# EAGLE schematic Grove  - XBee Carrier v1.0 (EAGLE 9.4.2)
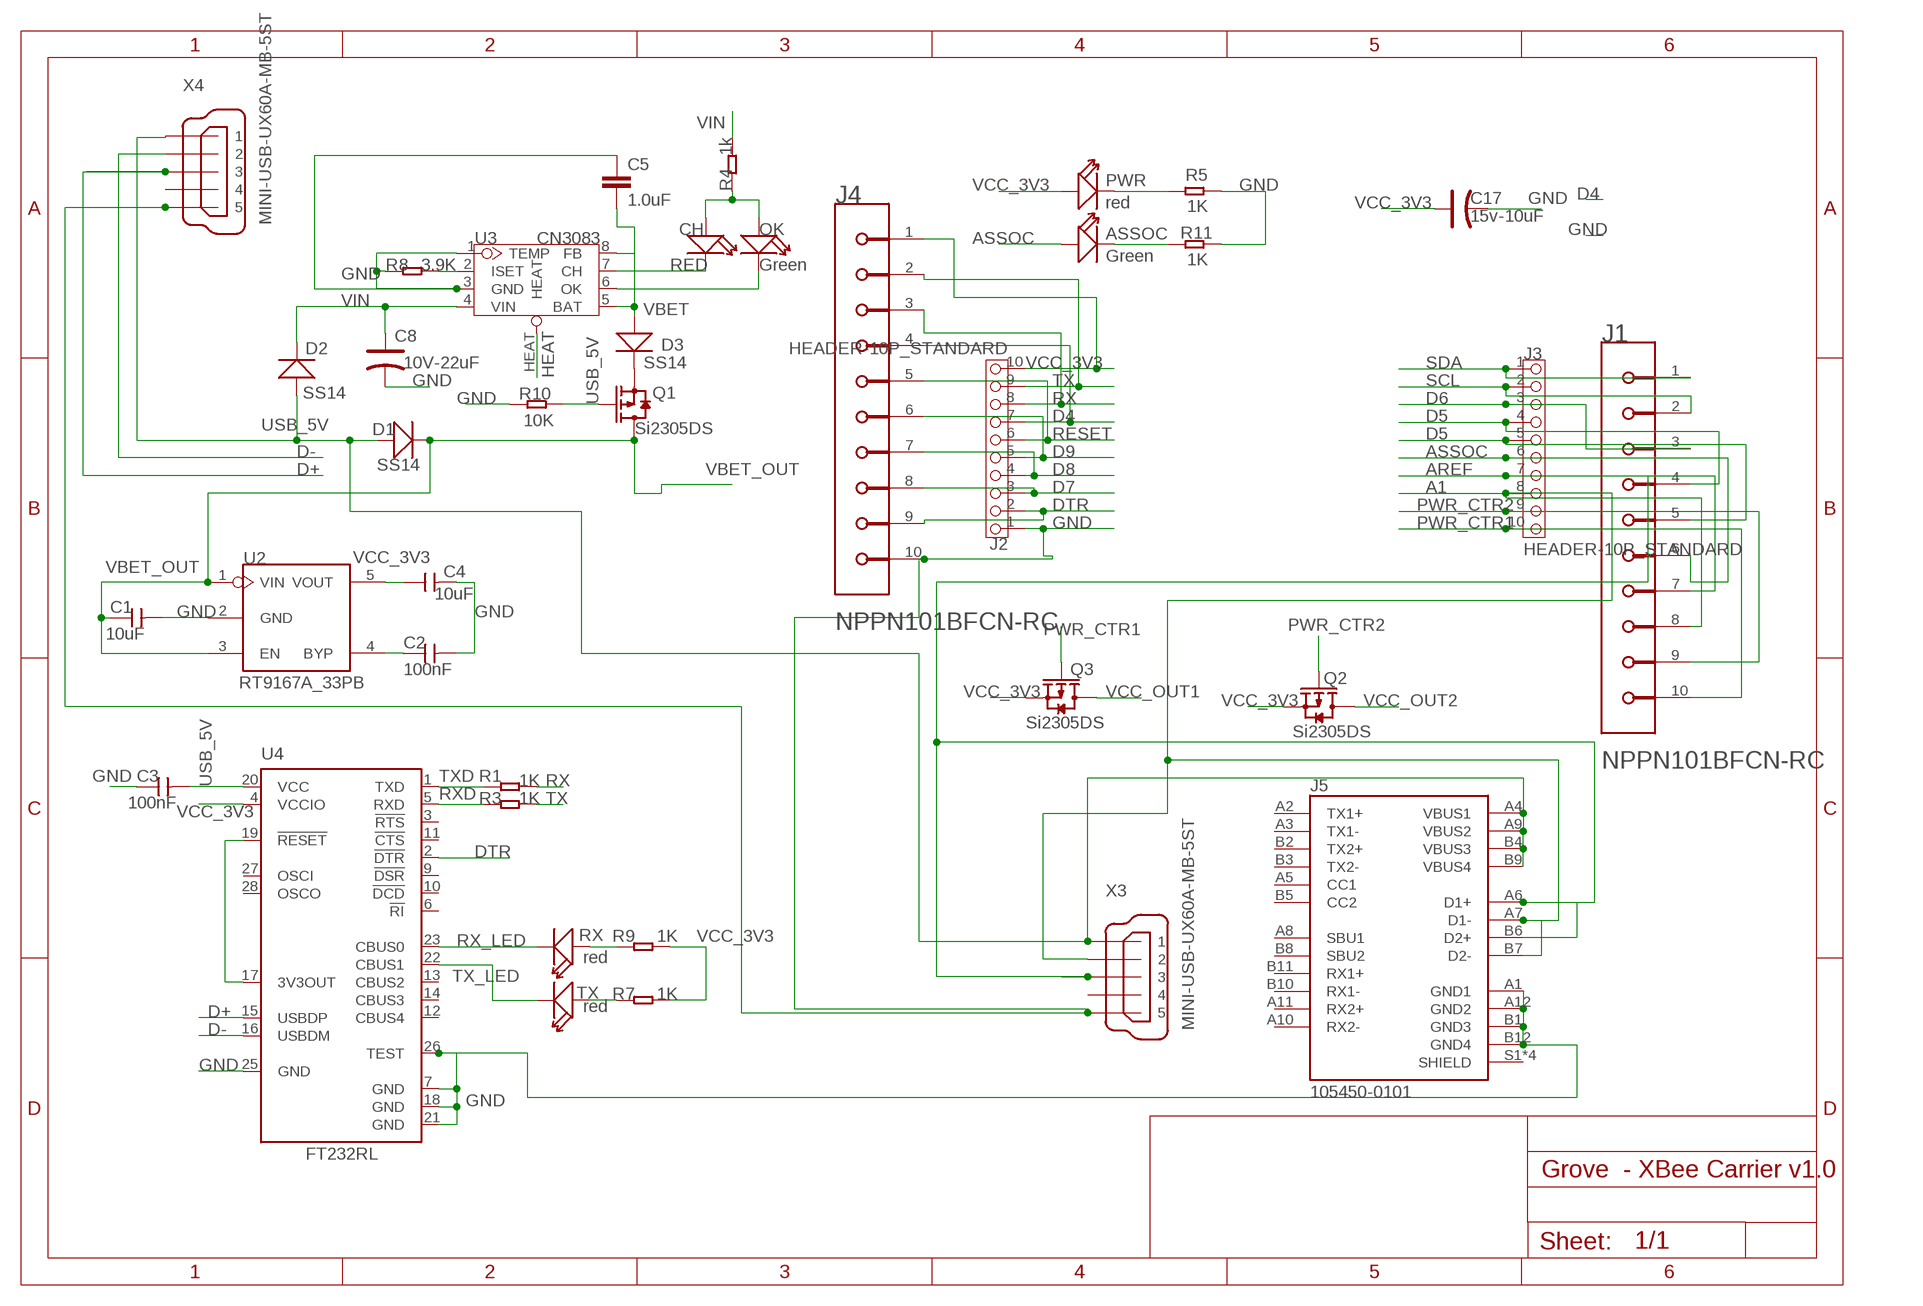
[diagram p0: schematic, sheet 1]

## Parts
ASSOC  Green  LED-0603  [D0603]
C1  10uF  C-0805  [0805]
C2  100nF  C-0603  [0603]
C3  100nF  C-0603  [0603]
C4  10uF  C-0805  [0805]
C5  1.0uF  1.0UF-0805-25V-10%  [0805]
C8  10V-22uF  CAP_AVX_B  [AVX-B]
C17  15v-10uF  CAP_AVX_A  [AVX-A]
CH  RED  LED-0603  [D0603]
D1  SS14  D-2010  [D2010]
D2  SS14  D-2010  [D2010]
D3  SS14  D-2010  [D2010]
J1  SULLINS_NPPN101BFCN-RCSULLINS_NPPN101BFCN-RC_0_0  [SULLINS_NPPN101BFCN-RC_0]
J2  HEADER-10P_STANDARD  [2.54_10P]
J3  HEADER-10P_STANDARD  [2.54_10P]
J4  SULLINS_NPPN101BFCN-RCSULLINS_NPPN101BFCN-RC_0_0  [SULLINS_NPPN101BFCN-RC_0]
J5  105450-0101  [MOLEX_105450-0101]
OK  Green  LED-0603  [D0603]
PWR  red  LED-0805  [D0805]
Q1  Si2305DS  010-P-MOSFETSOT23  [SOT23]
Q2  Si2305DS  010-P-MOSFETSOT23  [SOT23]
Q3  Si2305DS  010-P-MOSFETSOT23  [SOT23]
R1  1K  R-0603  [0603]
R3  1K  R-0603  [0603]
R4  1k  R-0603  [0603]
R5  1K  R-0603  [0603]
R7  1K  R-0603  [0603]
R8  3.9K  R-0603  [0603]
R9  1K  R-0603  [0603]
R10  10K  R-0603  [0603]
R11  1K  R-0603  [0603]
RX  red  LED-0603  [D0603]
TX  red  LED-0603  [D0603]
U2  RT9167A_33PB  RT9167A  [SOT23-5]
U3  CN3083  [SOP8]
U4  FT232RL  [SSOP28]
X3  MINI-USB-UX60A-MB-5ST  [UX60A-MB-5ST]
X4  MINI-USB-UX60A-MB-5ST  [UX60A-MB-5ST]

## Nets
A1: J1.8 J3.8 J5.A7(D1-) J5.B7(D2-) X3.2
AREF: J1.7 J3.7 J5.A6(D1+) J5.B6(D2+) X3.3
ASSOC: ASSOC.+ J1.6 J3.6
D4: J2.7 J4.4
D5: J1.4 J1.5 J3.4 J3.5
D6: J1.3 J3.3
D7: J2.3 J4.8
D8: J2.4 J4.7
D9: J2.5 J4.6
D+: U4.15(USBDP) X4.3
D-: U4.16(USBDM) X4.2
DTR: J2.2 J4.9 U4.2(!DTR)
GND: C1.2 C2.2 C3.1 C4.2 C5.1 C8.- C17.- J2.1 J4.10 J5.A1(GND1) J5.A12(GND2) J5.B1(GND3) J5.B12(GND4) R5.1 R8.1 R10.1 R11.1 U2.2(GND) U3.1(TEMP) U3.3(GND) U4.7(GND) U4.18(GND) U4.21(GND) U4.25(GND) U4.26(TEST) X3.5 X4.5
HEAT: U3.HEAT
N$1: PWR.- R5.2
N$2: R8.2 U3.2(ISET)
N$6: C2.1 U2.4(BYP)
N$7: CH.- U3.7(CH)
N$8: OK.- U3.6(OK)
N$9: CH.+ OK.+ R4.1
N$10: U4.17(3V3OUT) U4.19(!RESET)
N$11: D3.- Q1.2(S)
N$12: ASSOC.- R11.2
N$15: R9.1 RX.+
N$16: R7.1 TX.+
PWR_CTR1: J1.10 J3.10 Q3.1(G)
PWR_CTR2: J1.9 J3.9 Q2.1(G)
RESET: J2.6 J4.5
RX: J2.8 J4.3 R1.2
RX_LED: RX.- U4.23(CBUS0)
RXD: R3.1 U4.5(RXD)
SCL: J1.2 J3.2
SDA: J1.1 J3.1
TX: J2.9 J4.2 R3.2
TX_LED: TX.- U4.22(CBUS1)
TXD: R1.1 U4.1(TXD)
USB_5V: C3.2 D1.+ D2.+ J5.A4(VBUS1) J5.A9(VBUS2) J5.B4(VBUS3) J5.B9(VBUS4) Q1.1(G) R10.2 U4.20(VCC) X3.1 X4.1
VBET: C5.2 D3.+ U3.5(BAT) U3.8(FB)
VBET_OUT: C1.1 D1.- Q1.3(D) U2.1(VIN) U2.3(EN)
VCC_3V3: C4.1 C17.+ J2.10 J4.1 PWR.+ Q2.2(S) Q3.2(S) R7.2 R9.2 U2.5(VOUT) U4.4(VCCIO)
VCC_OUT1: Q3.3(D)
VCC_OUT2: Q2.3(D)
VIN: C8.+ D2.- R4.2 U3.4(VIN)
Unconnected: J5.A2(TX1+) J5.A3(TX1-) J5.A5(CC1) J5.A8(SBU1) J5.A10(RX2-) J5.A11(RX2+) J5.B2(TX2+) J5.B3(TX2-) J5.B5(CC2) J5.B8(SBU2) J5.B10(RX1-) J5.B11(RX1+) J5.S1(SHIELD) J5.S2(SHIELD) J5.S3(SHIELD) J5.S4(SHIELD) U4.3(!RTS) U4.6(!RI) U4.9(!DSR) U4.10(!DCD) U4.11(!CTS) U4.12(CBUS4) U4.13(CBUS2) U4.14(CBUS3) U4.27(OSCI) U4.28(OSCO) X3.4 X4.4

## Library data of the parts
ASSOC CH OK PWR RX TX = discrete:LED*
C1-C4 = discrete:C*: Ceramic Capacitors
C5 = SparkFun-Capacitors:1.0UF: 1µF ceramic capacitors A capacitor is a passive two-terminal electrical component used to store electrical energy temporarily in an electric field.; PROD_ID: CAP-08064
C8 C17 = discrete:CAP*: Electrolytic Capacitors,Tantalum Capacitors and Super Capacitors
D1-D3 = discrete:D*
J1 J4 = Sullins - NPPN101BFCN-RC:SULLINS_NPPN101BFCN-RC: HEADER, FEMALE 2mm CC, 1 ROW, ST; CENTROID_NOT_SPECIFIED: No; CONNECTOR_TYPE: Female; DATASHEET: http://www.sullinscorp.com/drawings/75_1BFC_10483.pdf; DIGIKEY_DESCRIPTION: CONN RECEPT 2MM SINGLE STR 10POS; DIGIKEY_PART_NUMBER: S5751-10-ND; IS_FEMALE: yes; LEAD_FREE: yes; MF: Sullins; MPN: NPPN101BFCN-RC; NUMBER_OF_PINS: 10; NUM_PINS: 10; PACKAGE: CONN_PTH_RCT10; PIN_PITCH: 2 mm; PREFIX: J; ROHS: yes; ROWS: 1; TEMPERATURE_RANGE_HIGH: +105°C; TEMPERATURE_RANGE_LOW: -40°C
J2 J3 = Connector:HEADER-10P
J5 = 105450-0101:105450-0101: USB Shielded I/O Receptacle; Type C; Right Angle; Surface Mount; Gold over Nickel; DESCRIPTION: USB Shielded I/O Receptacle; Type C; Right Angle; Surface Mount; Gold over Nickel; DIGI-KEY_PART_NUMBER: WM12856CT-ND; DIGI-KEY_PURCHASE_URL: https://www.digikey.com/product-detail/en/molex/1054500101/WM12856CT-ND/5843891?utm_source=snapeda&utm_medium=aggregator&utm_campaign=symbol; MF: Molex; MP: 1054500101; PACKAGE: None
Q1-Q3 = discrete:010-P-MOSFET*: Si2305DS Si2323CDS
R1 R3-R5 R7-R11 = discrete:R*
U2 = IC:RT9167A: Voltage regulator
U3 = IC:CN3083
U4 = IC:FT232R: Source: http://www.ftdichip.com/Documents/DataSheets/DS_FT232R_v104.pdf
X3 X4 = con-hirose:MINI-USB-: MINI USB Connector Source: http://www.hirose.co.jp/cataloge_hp/e24000019.pdf; OC_FARNELL: unknown; OC_NEWARK: unknown

## Net classes
0 default: width 0.203 mm, drill 0.305 mm, clearance 0.127 mm